# Altium schematic sheet COMS0001_Beacon.SchDoc: BLUEsat Beacon
size A3; Author: Daniel Jedrychowski; Engineer: D. JEDRYCHOWSKI; Organization: BLUEsat Project; Address1: Room 419; Address2: School of EE&T; Address3: UNSW, NSW 2052; Address4: Australia; DocumentNumber: COMS0001; SheetNumber: 1; SheetTotal: 1; Description: Morse code continuous wave beacon based on EPROM; Version: 1.1
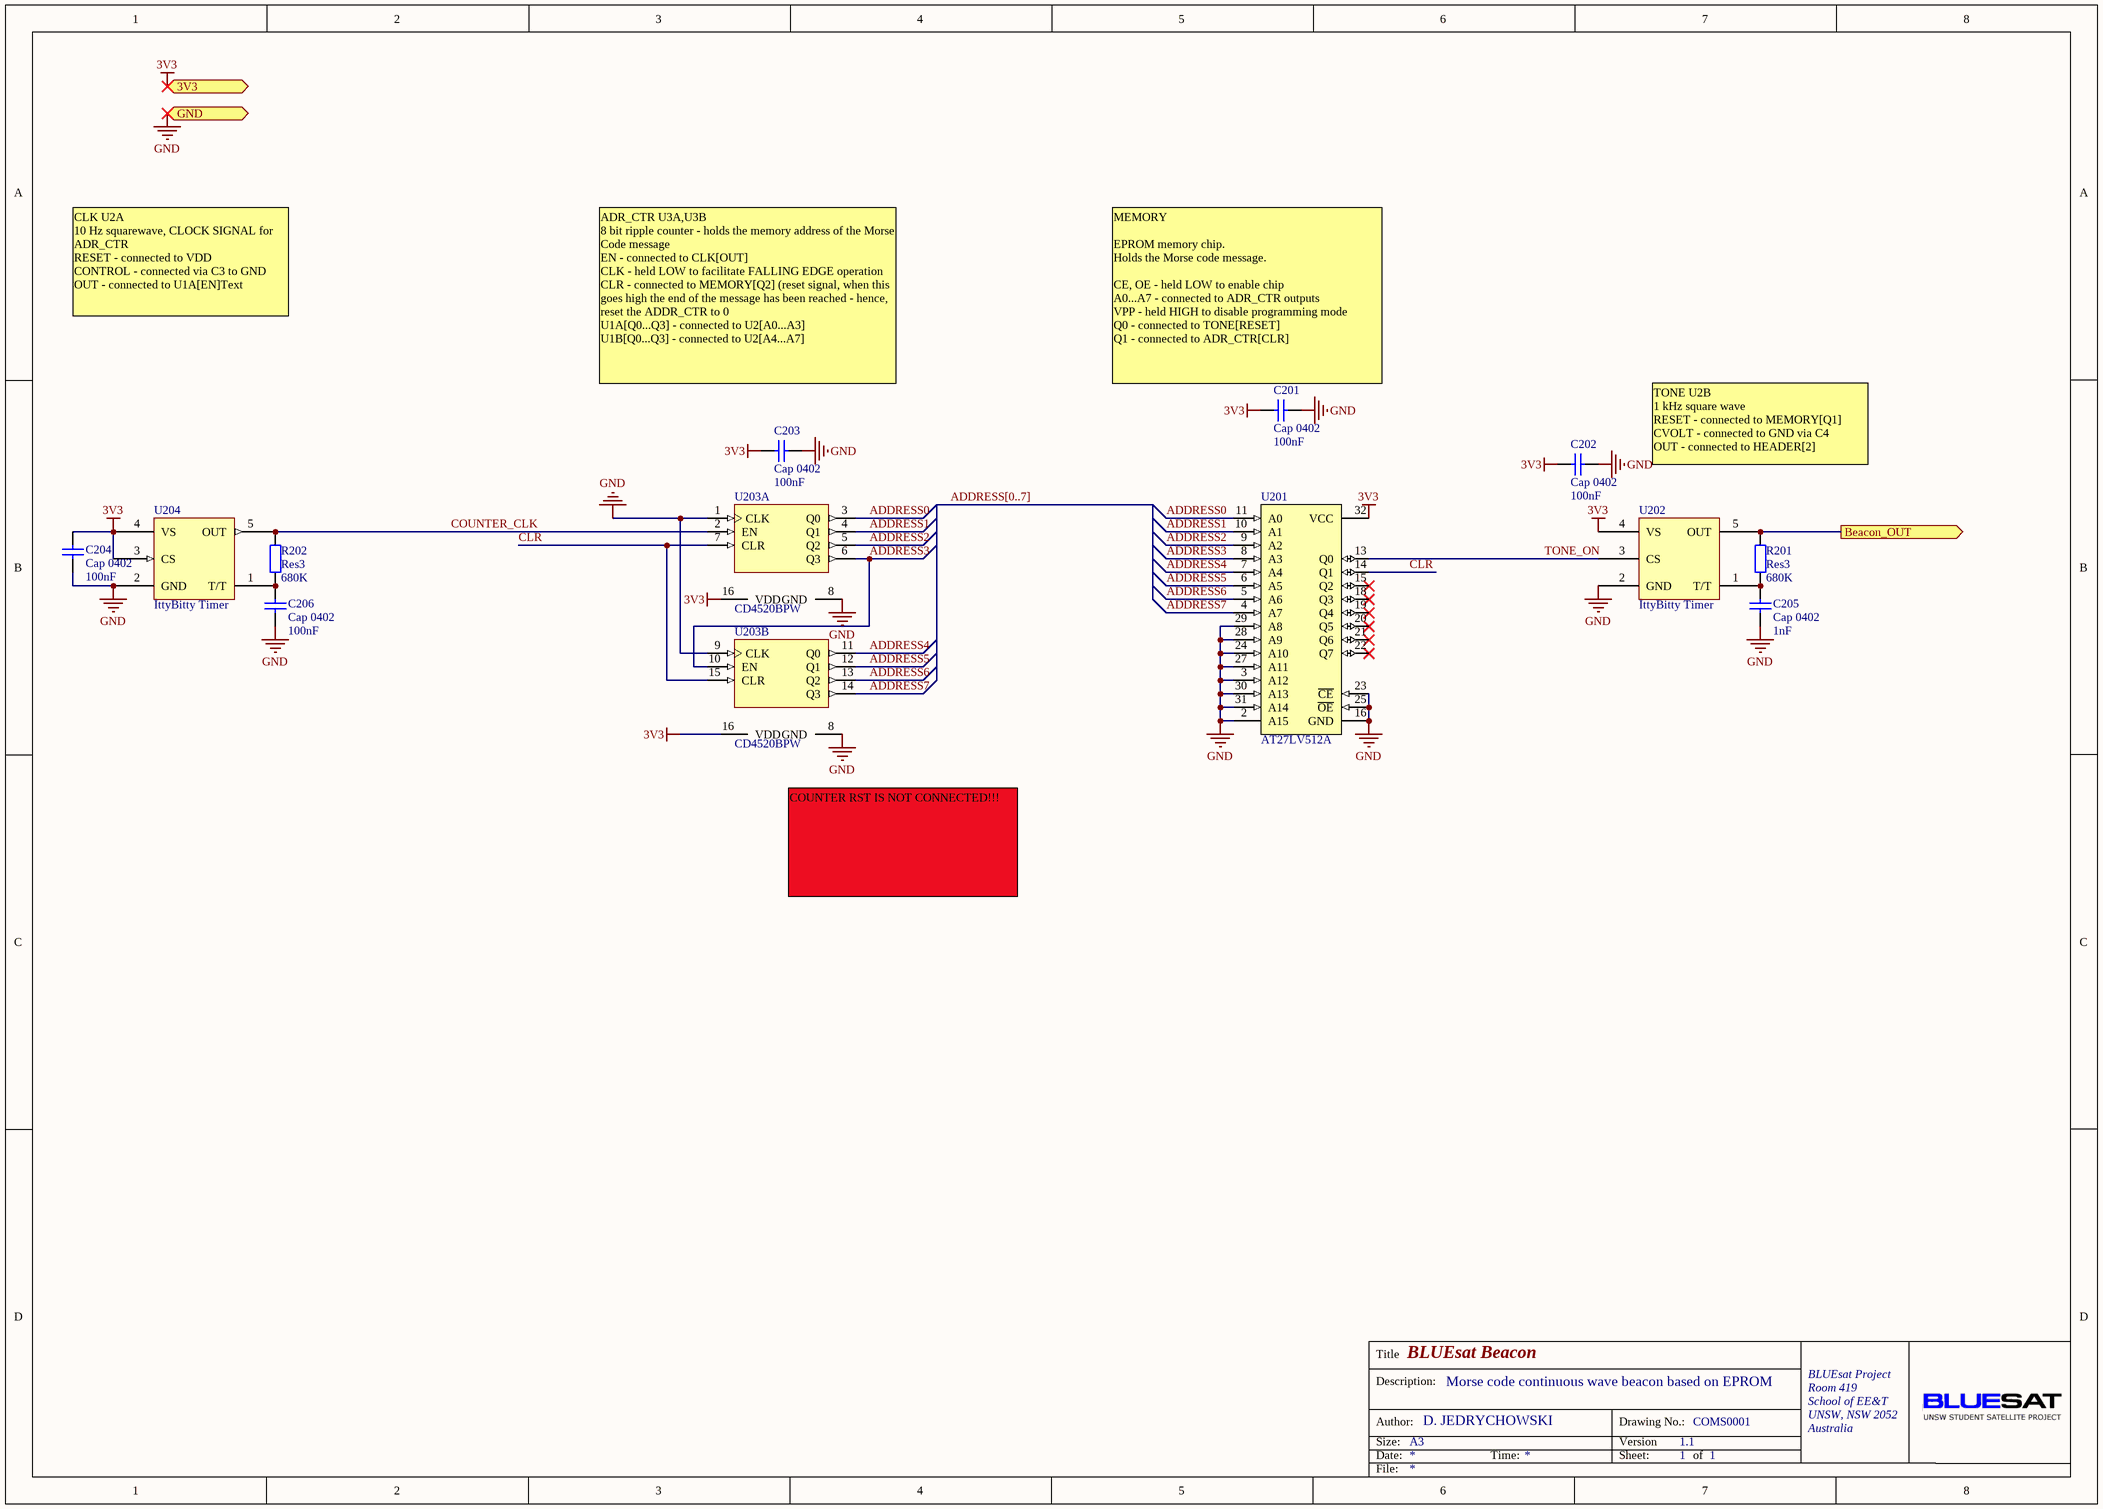
[diagram p0: COMS0001_Beacon.SchDoc]

## Parts
C201  Cap 0402  value 100nF  [CAPC1005X06L]
C202  Cap 0402  value 100nF  [CAPC1005X06L]
C203  Cap 0402  value 100nF  [CAPC1005X06L]
C204  Cap 0402  value 100nF  [CAPC1005X06L]
C205  Cap 0402  value 1nF  [CAPC1005X06L]
C206  Cap 0402  value 100nF  [CAPC1005X06L]
R201  Res3  value 680K  [RESC1005X06L]
R202  Res3  value 680K  [RESC1005X06L]
U201  AT27LV512A  [PLCC7*9]
U202  IttyBitty Timer  [SOT23-5]
U203  CD4520BPW  [TSSOP16]  (parts A,B of 2)
U204  IttyBitty Timer  [SOT23-5]

## Ports
3V3 (in), Beacon_OUT (out), GND (in)

## Nets
3V3: C201.1 C202.1 C203.1 C204.2 U201.32(VCC) U202.4(VS) U203.16(VDD) U204.3(CS) U204.4(VS) ; port 3V3
GND: C201.2 C202.2 C203.2 C204.1 C205.1 C206.1 U201.2(A15) U201.3(A12) U201.16(GND) U201.23(~{CE}) U201.24(A10) U201.25(~{OE}) U201.27(A11) U201.28(A9) U201.29(A8) U201.30(A13) U201.31(A14) U202.2(GND) U203.1(CLK) U203.8(GND) U203.9(CLK) U204.2(GND) ; port GND
ADDRESS0: U201.11(A0) U203.3(Q0)
ADDRESS1: U201.10(A1) U203.4(Q1)
ADDRESS2: U201.9(A2) U203.5(Q2)
ADDRESS3: U201.8(A3) U203.6(Q3) U203.10(EN)
ADDRESS4: U201.7(A4) U203.11(Q0)
ADDRESS5: U201.6(A5) U203.12(Q1)
ADDRESS6: U201.5(A6) U203.13(Q2)
ADDRESS7: U201.4(A7) U203.14(Q3)
Beacon_OUT: R201.1 U202.5(OUT) ; port Beacon_OUT
CLR: U201.14(Q1) U203.7(CLR) U203.15(CLR)
COUNTER_CLK: R202.1 U203.2(EN) U204.5(OUT)
TONE_ON: U201.13(Q0) U202.3(CS)
NetC205_2: C205.2 R201.2 U202.1(T/T)
NetC206_2: C206.2 R202.2 U204.1(T/T)

Not connected (* = marked no-connect by the designer): U201 15(Q2)* 18(Q3)* 19(Q4)* 20(Q5)* 21(Q6)* 22(Q7)*

## Buses and harness runs
bus ADDRESS[0..7]

## Notes on the sheet
- CLK U2A
  10 Hz squarewave, CLOCK SIGNAL for ADR_CTR
  RESET - connected to VDD
  CONTROL - connected via C3 to GND
  OUT - connected to U1A[EN]Text
- ADR_CTR U3A,U3B
  8 bit ripple counter - holds the memory address of the Morse Code message
  EN - connected to CLK[OUT]
  CLK - held LOW to facilitate FALLING EDGE operation
  CLR - connected to MEMORY[Q2] (reset signal, when this goes high the end of the message has been reached - hence, reset the ADDR_CTR to 0
  U1A[Q0...Q3] - connected to U2[A0...A3]
  U1B[Q0...Q3] - connected to U2[A4...A7]
- (near C201) MEMORY
  EPROM memory chip.
  Holds the Morse code message.
  CE, OE - held LOW to enable chip
  A0...A7 - connected to ADR_CTR outputs
  VPP - held HIGH to disable programming mode
  Q0 - connected to TONE[RESET]
  Q1 - connected to ADR_CTR[CLR]
- TONE U2B
  1 kHz square wave
  RESET - connected to MEMORY[Q1]
  CVOLT - connected to GND via C4
  OUT - connected to HEADER[2]
- COUNTER RST IS NOT CONNECTED!!!
- Title
- Description:
- Size:
- Author:
- Date:
- A3
- Time:
- Version
- Sheet:
- Drawing No.:
- of
- File:

## Library data of the parts
C201-C206 = Cap 0402: Capacitor; Published: 8-Jun-2000; LatestRevisionDate: 17-Jul-2002; LatestRevisionNote: Re-released for DXP Platform.; PackageReference: RAD-0.3; Publisher: Altium Limited; PackageDescription: Radial Cap, Thru-Hole; 2 Leads; 0.3 in Pin Spacing
R201 R202 = Res3: Resistor; Published: 8-Jun-2000; LatestRevisionDate: 29-May-2009; LatestRevisionNote: IPC-7351 Footprint Added.; PackageReference: J1-0603; Publisher: Altium Limited; PackageDescription: Chip Resistor
U201 = AT27LV512A: 512 Kbit (32Kb X 8) UV EPROM and OTP EPROM; Published: 24-Aug-2001; LatestRevisionDate: 06-Jun-2005; LatestRevisionNote: Stylized 3D Model Added.; DatasheetVersion: Jul-1998; PackageVersion: Jan-2003; PackageReference: PDIP28; Publisher: Altium Limited; PackageDescription: DIP; 28 Leads; Row Spacing 15.24 mm; Pitch 2.54 mm; ComponentLink1Description: Manufacturer Link; ComponentLink1URL: http://www.st.com/; ComponentLink2Description: Datasheet; ComponentLink2URL: http://www.st.com/stonline/products/literature/ds/2384/m27c256b.pdf; Supplier 1: Digi-Key; Supplier Part Number 1: AT27LV256A-70RC-ND
U202 U204 = MIC1557: Miniature Astable Timer Chip; Supplier: Farnell; Supplier Part Number: 1517241
U203 = CD4520BPW: Dual Binary Up-Counter; Supplier 1: Farnell; Supplier Part Number 1: 1752815